# EAGLE design rasp universal (EAGLE 7.3.0)
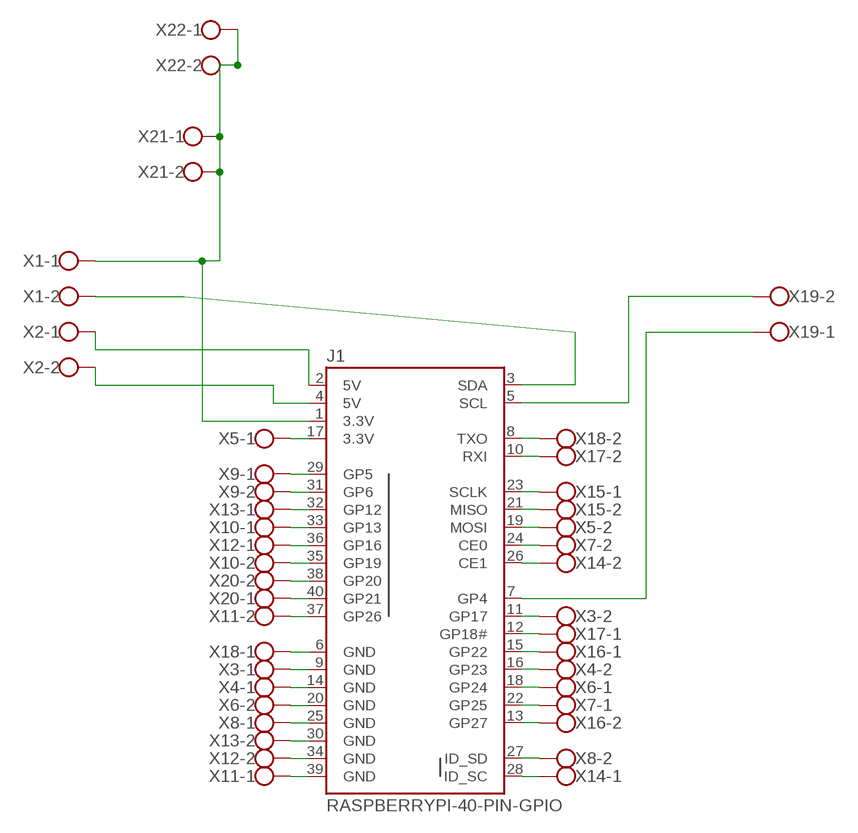
[diagram p0: schematic, sheet 1]

## Parts
J1  RASPBERRYPI-40-PIN-GPIO  [2X20-SHROUDED]
X1  W237-102  [W237-102]
X2  W237-102  [W237-102]
X3  W237-102  [W237-102]
X4  W237-102  [W237-102]
X5  W237-102  [W237-102]
X6  W237-102  [W237-102]
X7  W237-102  [W237-102]
X8  W237-102  [W237-102]
X9  W237-102  [W237-102]
X10  W237-102  [W237-102]
X11  W237-102  [W237-102]
X12  W237-102  [W237-102]
X13  W237-102  [W237-102]
X14  W237-102  [W237-102]
X15  W237-102  [W237-102]
X16  W237-102  [W237-102]
X17  W237-102  [W237-102]
X18  W237-102  [W237-102]
X19  W237-102  [W237-102]
X20  W237-102  [W237-102]
X21  W237-102  [W237-102]
X22  W237-102  [W237-102]

## Nets
N$1: J1.1(3.3V) X1.1 X21.1 X21.2 X22.1 X22.2
N$2: J1.3(SDA) X1.2
N$3: J1.2(5V) X2.1
N$4: J1.4(5V) X2.2
N$5: J1.5(SCL) X19.2
N$6: J1.7(GP4) X19.1
N$7: J1.6(GND) X18.1
N$8: J1.8(TXO) X18.2
N$9: J1.9(GND) X3.1
N$10: J1.11(GP17) X3.2
N$11: J1.12(GP18#) X17.1
N$12: J1.10(RXI) X17.2
N$13: J1.15(GP22) X16.1
N$14: J1.13(GP27) X16.2
N$15: J1.14(GND) X4.1
N$16: J1.16(GP23) X4.2
N$17: J1.17(3.3V) X5.1
N$18: J1.19(MOSI) X5.2
N$19: J1.20(GND) X6.2
N$20: J1.18(GP24) X6.1
N$21: J1.23(SCLK) X15.1
N$22: J1.21(MISO) X15.2
N$23: J1.24(CE0) X7.2
N$24: J1.22(GP25) X7.1
N$25: J1.27(ID_SD) X8.2
N$26: J1.25(GND) X8.1
N$27: J1.28(ID_SC) X14.1
N$28: J1.26(CE1) X14.2
N$29: J1.29(GP5) X9.1
N$30: J1.31(GP6) X9.2
N$31: J1.32(GP12) X13.1
N$32: J1.30(GND) X13.2
N$33: J1.35(GP19) X10.2
N$34: J1.33(GP13) X10.1
N$35: J1.36(GP16) X12.1
N$36: J1.34(GND) X12.2
N$37: J1.39(GND) X11.1
N$38: J1.37(GP26) X11.2
N$39: J1.40(GP21) X20.1
N$40: J1.38(GP20) X20.2

## Library data of the parts
J1 = SparkFun-Boards:RASPBERRYPI-40-PIN-GPIO: Second Generation Raspberry Pi GPIO Header 2x20 pin connector, as found on B, B+, A+ models.
X1-X22 = con-wago-500:W237-102: WAGO SCREW CLAMP; MPN: 237-102; OC_FARNELL: unknown; OC_NEWARK: 70K9898

## Board
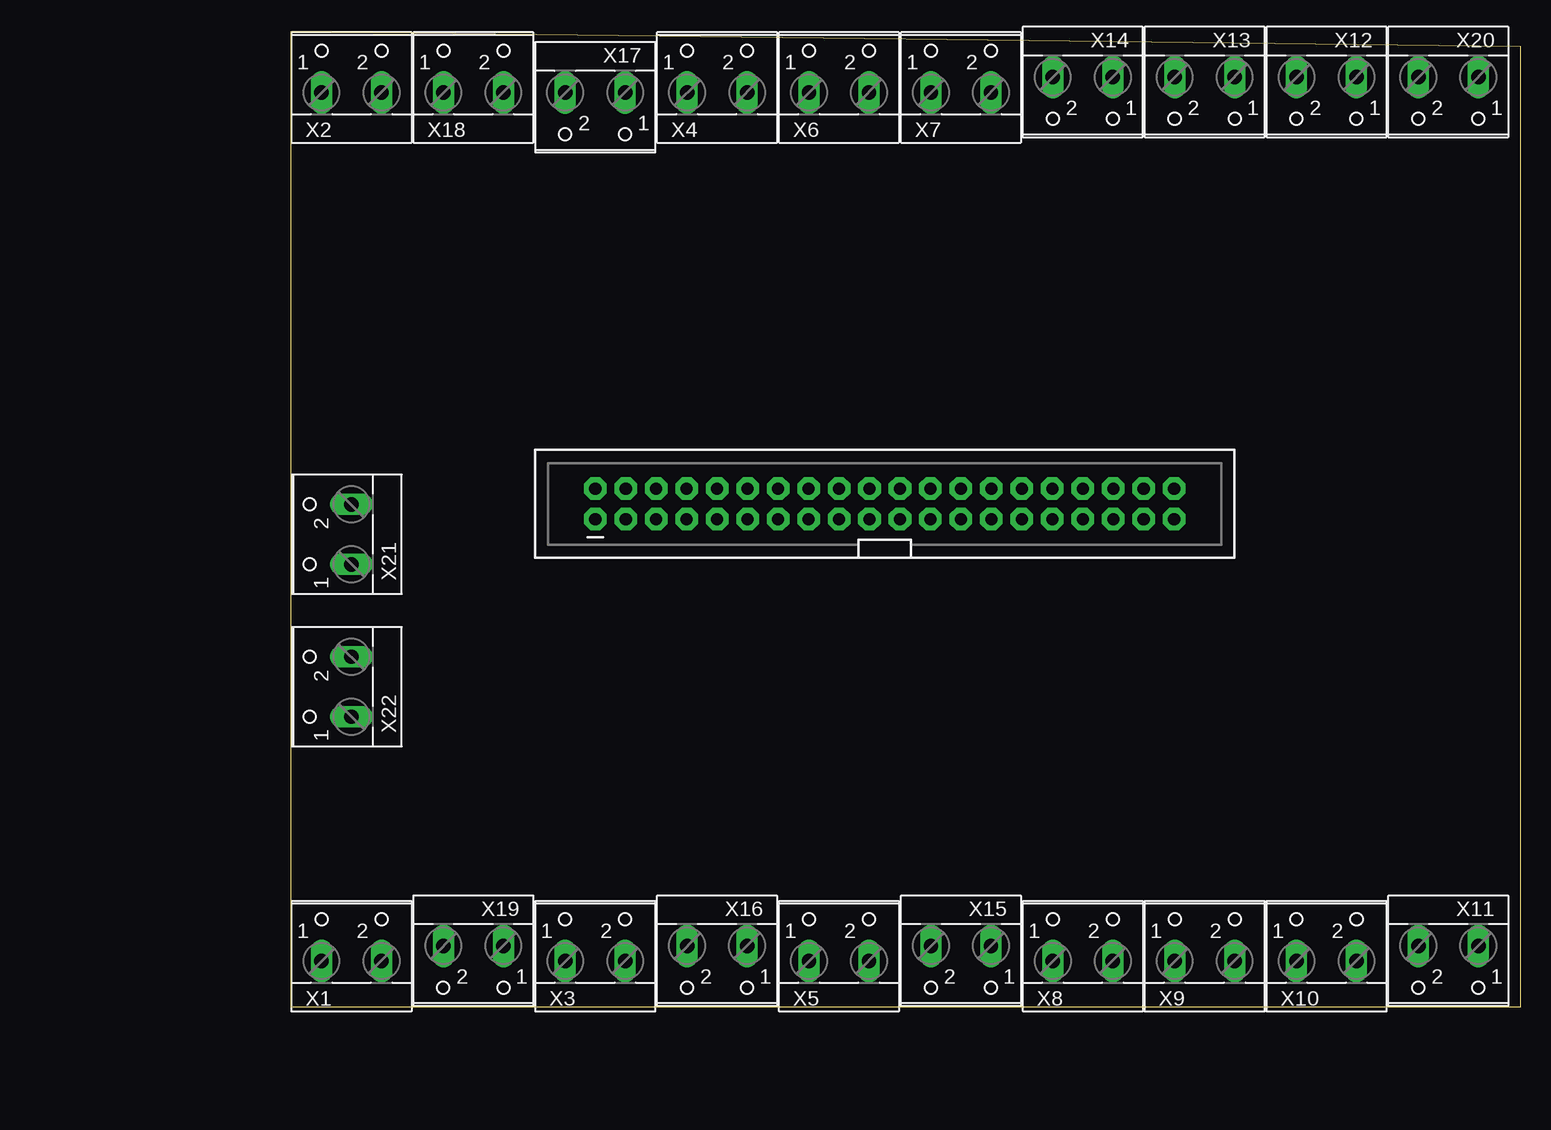
[diagram p1: board, top side]
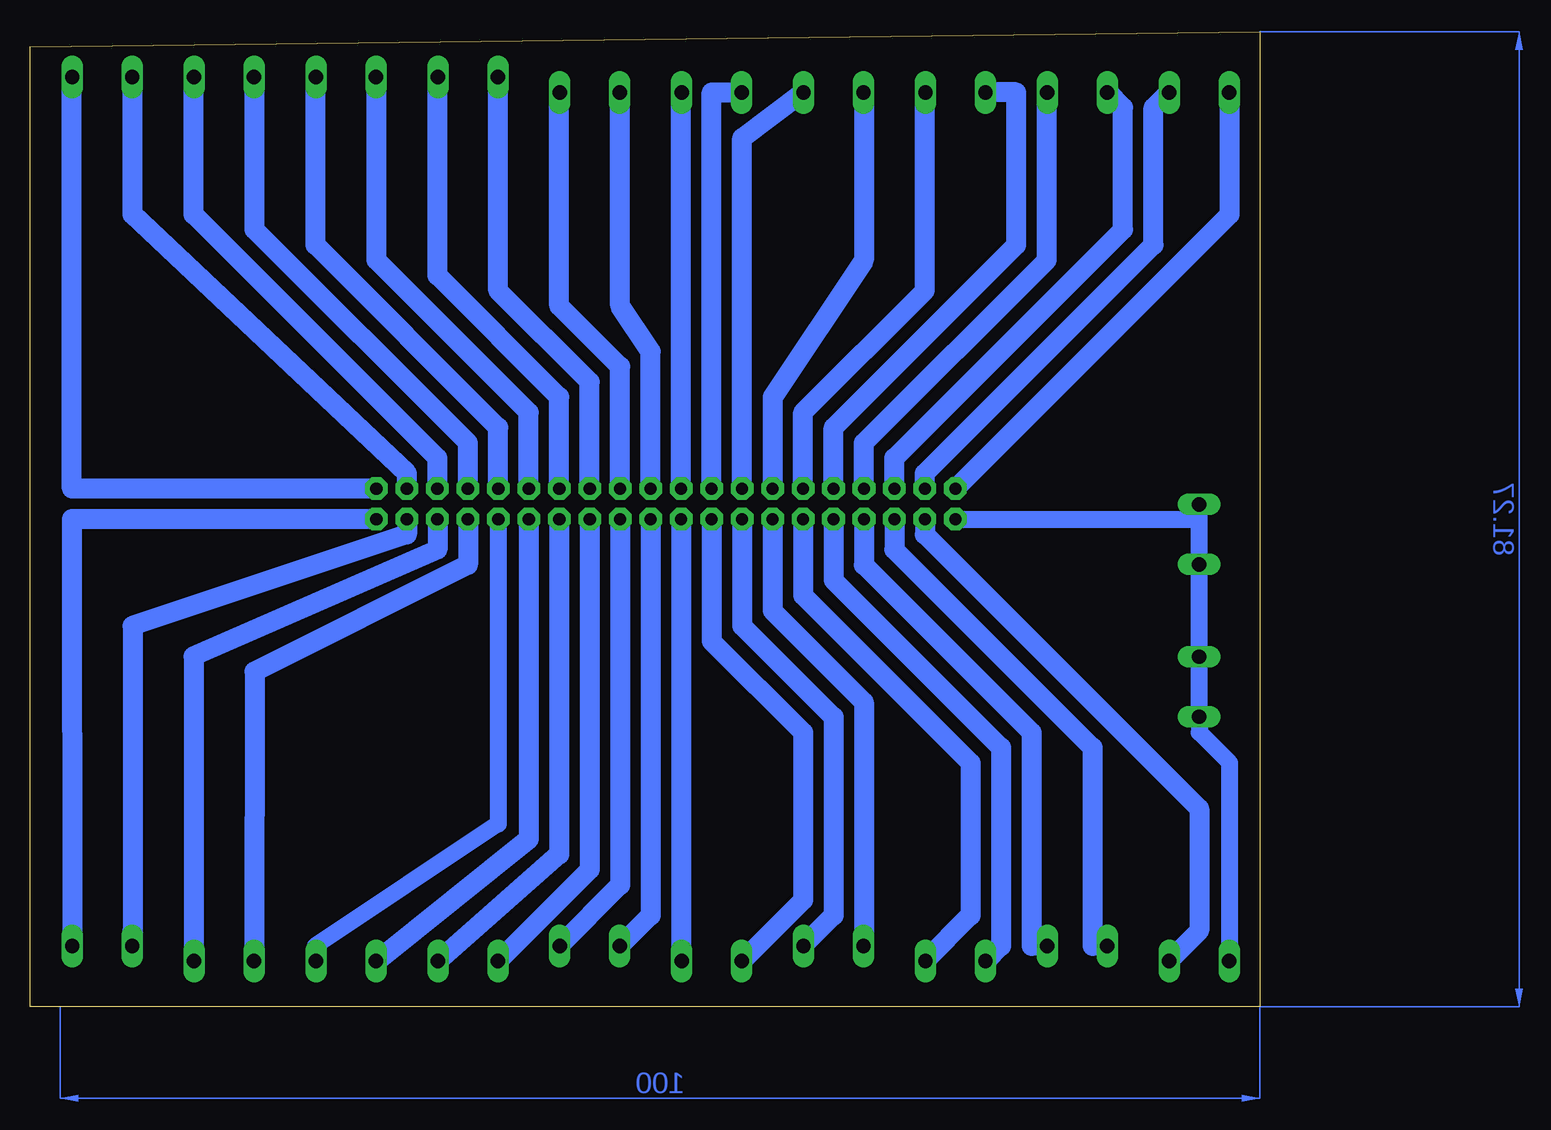
[diagram p2: board, bottom side, seen from below]

Size 102.54 x 81.27 mm. Coordinates in mm from the lower left corner, seen from the top.
Outline: 0,0 102.54,0 102.54,80 0,81.27 0,0
Copper layers (1*16): Top 0.035mm / dielectric 1.5mm / Bottom 0.035mm
Design rules "default": minimum track width 10mil, minimum drill 24mil, track to track 8mil, track to pad 8mil, pad to pad 8mil, via to via 8mil, smd to smd 8mil, copper to edge 40mil, drill to drill 8mil, minimum pad ring 10mil, minimum via ring 8mil, stop-mask expansion 4mil, vias tented up to drill 0mil, thermal gap 10mil

### Footprints (pad centres in the part's own frame; a part is rotated, then mirrored left to right if it is on the bottom)
2X20-SHROUDED = drill 1.016 pad 1.88 octagon: 1 -1.27,24.13; 2 1.27,24.13; 3 -1.27,21.59; 4 1.27,21.59; 5 -1.27,19.05; 6 1.27,19.05; 7 -1.27,16.51; 8 1.27,16.51; 9 -1.27,13.97; 10 1.27,13.97; 11 -1.27,11.43; 12 1.27,11.43; 13 -1.27,8.89; 14 1.27,8.89; 15 -1.27,6.35; 16 1.27,6.35; 17 -1.27,3.81; 18 1.27,3.81; 19 -1.27,1.27; 20 1.27,1.27; 21 -1.27,-1.27; 22 1.27,-1.27; 23 -1.27,-3.81; 24 1.27,-3.81; 25 -1.27,-6.35; 26 1.27,-6.35; 27 -1.27,-8.89; 28 1.27,-8.89; 29 -1.27,-11.43; 30 1.27,-11.43; 31 -1.27,-13.97; 32 1.27,-13.97; 33 -1.27,-16.51; 34 1.27,-16.51; 35 -1.27,-19.05; 36 1.27,-19.05; 37 -1.27,-21.59; 38 1.27,-21.59; 39 -1.27,-24.13; 40 1.27,-24.13
W237-102 = drill 1.194 long: 1 -2.5,-1.27; 2 2.5,-1.27

### Placement (x,y rotation side)
J1  49.53,41.91 90 top
X1  5.08,5.08 0 top
X2  5.08,77.47 0 top
X3  25.4,5.08 0 top
X4  35.56,77.47 0 top
X5  45.72,5.08 0 top
X6  45.72,77.47 0 top
X7  55.88,77.47 0 top
X8  66.04,5.08 0 top
X9  76.2,5.08 0 top
X10  86.36,5.08 0 top
X11  96.52,3.81 180 top
X12  86.36,76.2 180 top
X13  76.2,76.2 180 top
X14  66.04,76.2 180 top
X15  55.88,3.81 180 top
X16  35.56,3.81 180 top
X17  25.4,74.93 180 top
X18  15.24,77.47 0 top
X19  15.24,3.81 180 top
X20  96.52,76.2 180 top
X21  3.81,39.37 90 top
X22  3.81,26.67 90 top

### Tracks (layer width: path | path; a pad name or v marks a point on that pad's centre or on a via)
N$1
  Bottom 1.422: 5.08,40.64 X21.1 X22.2 X22.1 5.08,24.13 5.08,22.86 2.54,20.32 2.54,3.81 X1.1 | 5.08,40.64 X21.2 5.08,41.91 | J1.1 5.08,40.64
N$2
  Bottom 1.676: J1.3 27.94,39.37 5.08,16.51 5.08,6.35 7.62,3.81 X1.2
N$3
  Bottom 1.676: J1.2 2.54,66.04 2.54,76.2 X2.1
N$4
  Bottom 1.676: X2.2 7.62,76.2 8.89,74.93 8.89,63.5 27.94,44.45 J1.4
N$5
  Bottom 1.676: 12.7,5.08 X19.2 13.97,5.08 13.97,21.59 30.48,38.1 J1.5
N$6
  Bottom 1.676: X19.1 19.05,5.08 19.05,22.86 33.02,36.83 J1.7
N$7
  Bottom 1.676: J1.6 30.48,45.72 11.43,64.77 11.43,74.93 12.7,76.2 X18.1
N$8
  Bottom 1.676: J1.8 33.02,46.99 17.78,62.23 17.78,76.2 X18.2
N$9
  Bottom 1.676: J1.9 35.56,35.56 21.59,21.59 21.59,5.08 22.86,3.81 X3.1
N$10
  Bottom 1.676: J1.11 38.1,34.29 24.13,20.32 24.13,7.62 27.94,3.81 X3.2
N$11
  Bottom 1.676: J1.12 38.1,49.53 27.94,59.69 27.94,76.2 X17.1
N$12
  Bottom 1.676: J1.10 35.56,48.26 20.32,63.5 20.32,76.2 X17.2
N$13
  Bottom 1.676: J1.15 43.18,31.75 35.56,24.13 35.56,7.62 38.1,5.08 X16.1
N$14
  Bottom 1.676: J1.13 40.64,33.02 33.02,25.4 33.02,5.08 X16.2
N$15
  Bottom 1.676: X4.1 33.02,76.2 33.02,62.23 40.64,50.8 J1.14
N$16
  Bottom 1.676: J1.16 43.18,72.39 38.1,76.2 X4.2
N$17
  Bottom 1.676: J1.17 45.72,30.48 38.1,22.86 38.1,8.89 43.18,3.81 X5.1
N$18
  Bottom 1.676: J1.19 48.26,3.81 X5.2
N$19
  Bottom 1.676: X6.2 48.26,76.2 J1.20
N$20
  Bottom 1.676: J1.18 45.72,76.2 X6.1 43.18,76.2
N$21
  Bottom 1.676: X15.1 53.34,10.16 J1.23
N$22
  Bottom 1.676: J1.21 50.8,7.62 53.34,5.08 X15.2
N$23
  Bottom 1.676: X7.2 58.42,76.2 58.42,58.42 53.34,53.34 J1.24
N$24
  Bottom 1.676: J1.22 50.8,54.61 53.34,58.42 53.34,76.2 X7.1
N$25
  Bottom 1.676: J1.27 58.42,12.7 X8.2
N$26
  Bottom 1.676: J1.25 55.88,11.43 X8.1
N$27
  Bottom 1.676: J1.28 58.42,50.8 68.58,60.96 68.58,77.47 X14.1
N$28
  Bottom 1.676: J1.26 55.88,52.07 63.5,59.69 63.5,77.47 X14.2
N$29
  Bottom 1.676: J1.29 60.96,13.97 73.66,3.81 X9.1
N$30
  Bottom 1.422: J1.31 63.5,15.24 78.74,5.08 78.74,3.81 X9.2
N$31
  Bottom 1.676: X13.1 78.74,77.47 78.74,63.5 63.5,48.26 J1.32
N$32
  Bottom 1.676: J1.30 60.96,49.53 73.66,62.23 73.66,77.47 X13.2
N$33
  Bottom 1.676: X10.2 88.9,3.81 88.9,29.21 68.58,38.1 J1.35
N$34
  Bottom 1.676: X10.1 83.82,27.94 66.04,36.83 J1.33
N$35
  Bottom 1.676: J1.36 68.58,45.72 88.9,66.04 88.9,77.47 X12.1
N$36
  Bottom 1.676: J1.34 66.04,46.99 83.82,64.77 83.82,77.47 X12.2
N$37
  Bottom 1.676: J1.39 99.06,40.64 X11.1
N$38
  Bottom 1.676: J1.37 71.12,39.37 93.98,31.75 93.98,6.35 X11.2
N$39
  Bottom 1.676: J1.40 99.06,43.18 99.06,77.47 X20.1
N$40
  Bottom 1.676: X20.2 93.98,77.47 93.98,66.04 71.12,44.45 J1.38
(copper drawn outside any net)
  shapes: Bottom area x2